# Altium schematic sheet 3V3_LDO_0603.SchDoc
size A
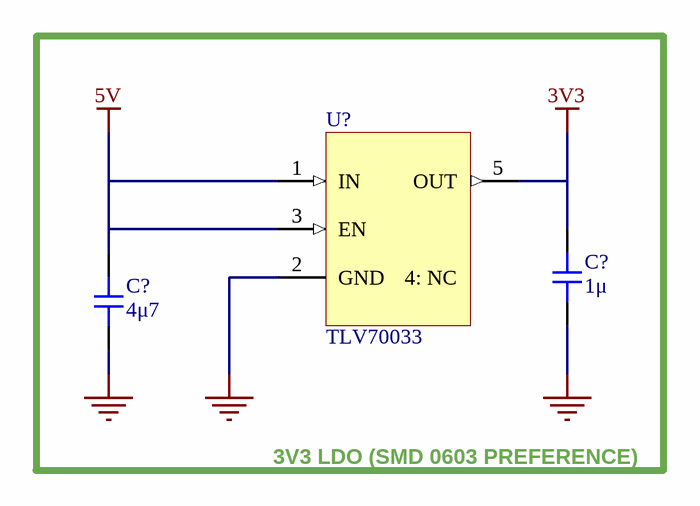
[diagram p0: 3V3_LDO_0603.SchDoc]

## Parts
(Parts that share a designator on the sheet are numbered #1, #2 ... from top to bottom, then left to right.)
C?#1  1μ  [MJB_CAP_0603]
C?#2  4μ7  [MJB_CAP_0603]
U?  TLV70033  [MJB_TPS763x]

## Blocks framed on the sheet
3V3 LDO (SMD 0603 PREFERENCE): C?#1 C?#2 U?

## Nets
3V3: C?#1.2 U?.5(OUT)
5V: C?#2.2 U?.1(IN) U?.3(EN)
GND: C?#1.1 C?#2.1 U?.2(GND)

## Notes on the sheet
- (in symbol TPS76333) 4: NC

## Library data of the parts
C?#1 C?#2 = CAP_0603: Capacitor SMD 0603; Manufacturer: *; Manufacturer Part Number: *; Distributor Link: *; LCSC: *; Rating: *; Dielectric: *
U? = TPS76333